# EAGLE design pertamina (EAGLE 7.6.0)
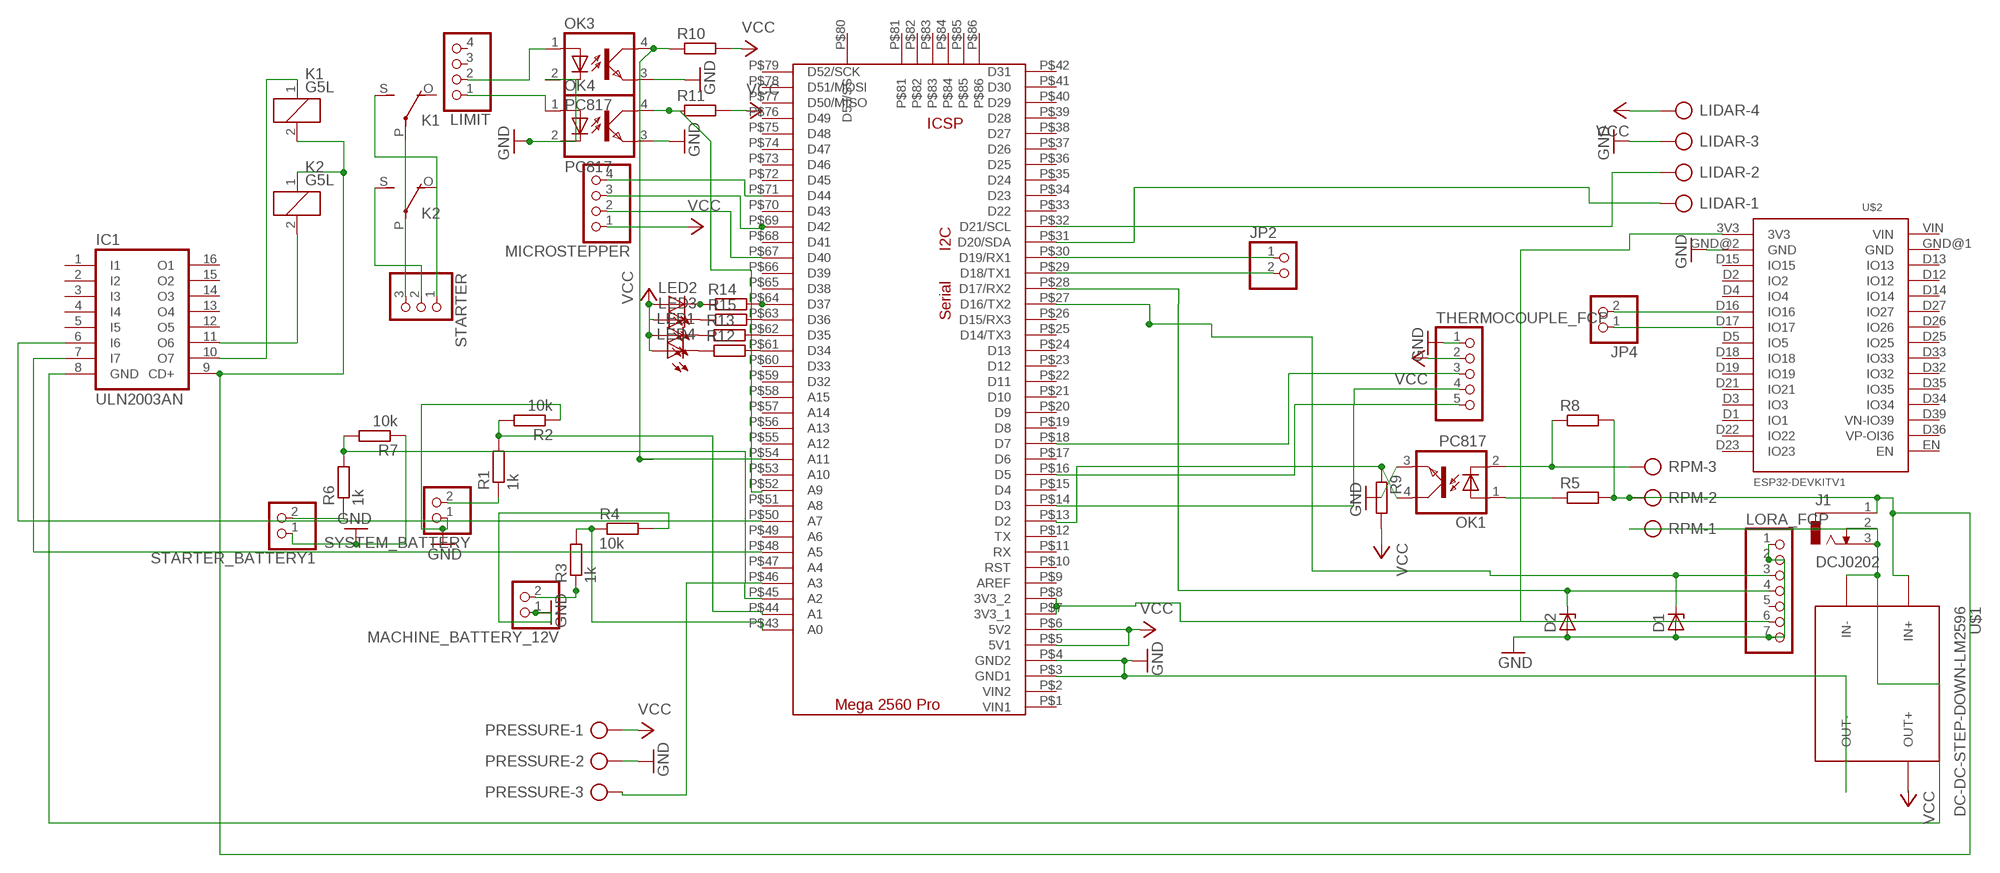
[diagram p0: schematic, sheet 1]

## Parts
D1  ZENER-DIODEDO35Z10  [DO35Z10]
D2  ZENER-DIODEDO35Z10  [DO35Z10]
IC1  ULN2003AN  [DIL16]
J1  DCJ0202  [DCJ0202]
JP2  PINHD-1X2  [1X02]
JP4  PINHD-1X2  [1X02]
K1  G5L  [G5LE]
K2  G5L  [G5LE]
LED1  LED5MM  [LED5MM]
LED2  LED5MM  [LED5MM]
LED3  LED5MM  [LED5MM]
LED4  LED5MM  [LED5MM]
LIDAR  AK300/4  [AK300/4]
LIMIT  PINHD-1X4  [1X04]
LORA_FCP  PINHD-1X7  [1X07]
MACHINE_BATTERY_12V  PINHD-1X2  [1X02]
MICROSTEPPER  PINHD-1X4  [1X04]
OK1  PC817  [DIL04]
OK3  PC817  [DIL04]
OK4  PC817  [DIL04]
PRESSURE  AK300/3  [AK300/3]
R1  1k  R-EU_0204/7  [0204/7]
R2  10k  R-EU_0204/7  [0204/7]
R3  1k  R-EU_0204/7  [0204/7]
R4  10k  R-EU_0204/7  [0204/7]
R5  R-EU_0204/7  [0204/7]
R6  1k  R-EU_0204/7  [0204/7]
R7  10k  R-EU_0204/7  [0204/7]
R8  R-EU_0204/7  [0204/7]
R9  R-EU_0204/7  [0204/7]
R10  R-EU_0204/7  [0204/7]
R11  R-EU_0204/7  [0204/7]
R12  R-EU_0204/7  [0204/7]
R13  R-EU_0204/7  [0204/7]
R14  R-EU_0204/7  [0204/7]
R15  R-EU_0204/7  [0204/7]
RPM  AK300/3  [AK300/3]
STARTER  PINHD-1X3  [1X03]
STARTER_BATTERY1  PINHD-1X2  [1X02]
SYSTEM_BATTERY  PINHD-1X2  [1X02]
THERMOCOUPLE_FCP  PINHD-1X5  [1X05]
U$1  DC-DC-STEP-DOWN-LM2596  [DC-DC-STEP-DOWN-LM2596]
U$2  ESP32DEVKITV1  [ESP32-DEVKITV1]
U$3  MEGAPROMINI  [MEGAPROMINI]

## Nets
3.3V: LORA_FCP.6 U$2.3V3 U$3.P$7(3V3_1) U$3.P$8(3V3_2)
5V: R1.2 R2.2 U$3.P$44(A1)
5V1: R6.2 R7.2 U$3.P$45(A2)
5V_ARDU: LED1.A LED2.A LED3.A LED4.A LIDAR.4 MICROSTEPPER.1 PRESSURE.1 R9.2 R10.2 R11.2 THERMOCOUPLE_FCP.2 U$1.OUT+ U$3.P$5(5V1) U$3.P$6(5V2) ; supply symbol labelled VCC
GND: D1.A D2.A LIDAR.3 LORA_FCP.1 LORA_FCP.2 LORA_FCP.7 MACHINE_BATTERY_12V.1 OK1.3(EMIT) OK3.2(C) OK3.3(EMIT) OK4.2(C) OK4.3(EMIT) PRESSURE.2 R2.1 R4.2 R7.1 STARTER_BATTERY1.1 SYSTEM_BATTERY.1 THERMOCOUPLE_FCP.1 U$1.OUT- U$2.GND@2(GND) U$3.P$3(GND1) U$3.P$4(GND2)
N$1: JP2.1 U$3.P$30(D19/RX1)
N$2: JP2.2 U$3.P$29(D18/TX1)
N$3: R3.2 R4.1 U$3.P$43(A0)
N$4: IC1.10(O7) K1.1
N$5: THERMOCOUPLE_FCP.5 U$3.P$16(D5)
N$6: THERMOCOUPLE_FCP.4 U$3.P$14(D3)
N$8: THERMOCOUPLE_FCP.3 U$3.P$18(D7)
N$9: D2.C LORA_FCP.4 U$3.P$28(D17/RX2)
N$10: R1.1 SYSTEM_BATTERY.2
N$11: IC1.9(CD+) J1.1 K1.2 K2.1 R5.2 R8.2 RPM.2 U$1.IN+
N$12: D1.C LORA_FCP.3 U$3.P$27(D16/TX2)
N$13: MACHINE_BATTERY_12V.2 R3.1
N$14: IC1.8(GND) J1.2 J1.3 RPM.1 U$1.IN-
N$15: OK1.1(A) R5.1
N$16: OK1.4(COL) R9.1 U$3.P$13(D2)
N$17: OK1.2(C) R8.1 RPM.3
N$18: JP4.1 U$2.D17(IO17)
N$19: JP4.2 U$2.D16(IO16)
N$21: IC1.7(I7) U$3.P$48(A5)
N$29: R6.1 STARTER_BATTERY1.2
N$30: R12.2 U$3.P$61(D34)
N$31: LED4.K(C) R12.1
N$32: R14.2 U$3.P$64(D37)
N$33: IC1.6(I6) U$3.P$50(A7)
N$34: MICROSTEPPER.4 U$3.P$71(D44)
N$37: MICROSTEPPER.2 U$3.P$67(D40)
N$38: MICROSTEPPER.3 U$3.P$69(D42)
N$41: PRESSURE.3 U$3.P$46(A3)
N$43: LED2.K(C) R14.1
N$44: IC1.11(O6) K2.2
N$45: R13.2 U$3.P$62(D35)
N$46: LED1.K(C) R13.1
N$47: R15.2 U$3.P$63(D36)
N$48: LED3.K(C) R15.1
N$49: LIMIT.1 OK4.1(A)
N$50: LIMIT.2 OK3.1(A)
N$51: OK4.4(COL) R11.1 U$3.P$52(A9)
N$53: K1.P(2:P) K2.P(2:P) STARTER.3
N$54: K2.S(2:S) STARTER.2
N$55: K1.S(2:S) STARTER.1
N$56: OK3.4(COL) R10.1 U$3.P$54(A11)
SCL: LIDAR.2 U$3.P$32(D21/SCL)
SDA: LIDAR.1 U$3.P$31(D20/SDA)
Unconnected: IC1.1(I1) IC1.2(I2) IC1.3(I3) IC1.4(I4) IC1.5(I5) IC1.12(O5) IC1.13(O4) IC1.14(O3) IC1.15(O2) IC1.16(O1) K1.O(2:O) K2.O(2:O) LIMIT.3 LIMIT.4 LORA_FCP.5 U$2.D1(IO1) U$2.D2(IO2) U$2.D3(IO3) U$2.D4(IO4) U$2.D5(IO5) U$2.D12(IO12) U$2.D13(IO13) U$2.D14(IO14) U$2.D15(IO15) U$2.D18(IO18) U$2.D19(IO19) U$2.D21(IO21) U$2.D22(IO22) U$2.D23(IO23) U$2.D25(IO25) U$2.D26(IO26) U$2.D27(IO27) U$2.D32(IO32) U$2.D33(IO33) U$2.D34(IO34) U$2.D35(IO35) U$2.D36(VP-OI36) U$2.D39(VN-IO39) U$2.EN U$2.GND@1(GND) U$2.VIN U$3.P$1(VIN1) U$3.P$2(VIN2) U$3.P$9(AREF) U$3.P$10(RST) U$3.P$11(RX) U$3.P$12(TX) U$3.P$15(D4) U$3.P$17(D6) U$3.P$19(D8) U$3.P$20(D9) U$3.P$21(D10) U$3.P$22(D11) U$3.P$23(D12) U$3.P$24(D13) U$3.P$25(D14/TX3) U$3.P$26(D15/RX3) U$3.P$33(D22) U$3.P$34(D23) U$3.P$35(D24) U$3.P$36(D25) U$3.P$37(D26) U$3.P$38(D27) U$3.P$39(D28) U$3.P$40(D29) U$3.P$41(D30) U$3.P$42(D31) U$3.P$47(A4) U$3.P$49(A6) U$3.P$51(A8) U$3.P$53(A10) U$3.P$55(A12) U$3.P$56(A13) U$3.P$57(A14) U$3.P$58(A15) U$3.P$59(D32) U$3.P$60(D33) U$3.P$65(D38) U$3.P$66(D39) U$3.P$68(D41) U$3.P$70(D43) U$3.P$72(D45) U$3.P$73(D46) U$3.P$74(D47) U$3.P$75(D48) U$3.P$76(D49) U$3.P$77(D50/MISO) U$3.P$78(D51/MOSI) U$3.P$79(D52/SCK) U$3.P$80(D53/SS) U$3.P$81 U$3.P$82 U$3.P$83 U$3.P$84 U$3.P$85 U$3.P$86

## Library data of the parts
D1 D2 = diode:ZENER-DIODE: Z-Diode
IC1 = uln-udn:ULN2003A: DRIVER ARRAY
J1 = con-jack:DCJ0202: DC POWER JACK Source: DCJ0202.pdf; OC_FARNELL: unknown; OC_NEWARK: unknown
JP2 JP4 MACHINE_BATTERY_12V STARTER_BATTERY1 SYSTEM_BATTERY = pinhead:PINHD-1X2: PIN HEADER
K1 K2 = relay:G5L: RELAY 1 x switch, 10 A/120 V AC, 8 A/30 V ADC, Omron; OC_FARNELL: unknown; OC_NEWARK: unknown
LED1-LED4 = led:LED: LED OSRAM: - CHIPLED LG R971, LG N971, LY N971, LG Q971, LY Q971, LO R971, LY R971 LH N974, LH R974 LS Q976, LO Q976, LY Q976 LO Q996 - Hyper CHIPLED LW Q18S LB Q993, LB Q99A, LB R99A - SideLED LS A670, LO A670, LY A670, LG A670, LP A670 LB A673, LV A673, LT A673, LW A673 LH A674 LY A675 LS A676, LA A676, LO A676, LY A676, LW A676 LS A679, LY A679, LG A679 - Hyper Micro SIDELED® LS Y876, LA Y876, LO Y876, LY Y876 LT Y87S - SmartLED LW L88C, LW L88S LB L89C, LB L89S, LG L890 LS L89K, LO L89K, LY L89K LS L896, LA L896, LO L896, LY L896 - TOPLED LS T670, LO T670, LY T670, LG T670, LP T670 LSG T670, LSP T670, LSY T670, LOP T670, LYG T670 LG T671, LOG T671, LSG T671 LB T673, LV T673, LT T673, LW T673 LH T674 LS T676, LA T676, LO T676, LY T676, LB T676, LH T676, LSB T676, LW T676 LB T67C, LV T67C, LT T67C, LS T67K, LO T67K, LY T67K, LW E67C LS E67B, LA E67B, LO E67B, LY E67B, LB E67C, LV E67C, LT E67C LW T67C LS T679, LY T679, LG T679 LS T770, LO T770, LY T770, LG T770, LP T770 LB T773, LV T773, LT T773, LW T773 LH T774 LS E675, LA E675, LY E675, LS T675 LS T776, LA T776, LO T776, LY T776, LB T776 LHGB T686 LT T68C, LB T68C - Hyper Mini TOPLED® LB M676 - Mini TOPLED Santana® LG M470 LS M47K, LO M47K, LY M47K Source: http://www.osram.convergy.de LUXEON: - LUMILED® LXK2-PW12-R00, LXK2-PW12-S00, LXK2-PW14-U00, LXK2-PW14-V00 LXK2-PM12-R00, LXK2-PM12-S00, LXK2-PM14-U00 LXK2-PE12-Q00, LXK2-PE12-R00, LXK2-PE12-S00, LXK2-PE14-T00, LXK2-PE14-U00 LXK2-PB12-K00, LXK2-PB12-L00, LXK2-PB12-M00, LXK2-PB14-N00, LXK2-PB14-P00, LXK2-PB14-Q00 LXK2-PR12-L00, LXK2-PR12-M00, LXK2-PR14-Q00, LXK2-PR14-R00 LXK2-PD12-Q00, LXK2-PD12-R00, LXK2-PD12-S00 LXK2-PH12-R00, LXK2-PH12-S00 LXK2-PL12-P00, LXK2-PL12-Q00, LXK2-PL12-R00 Source: www.luxeon.com KINGBRIGHT: KA-3528ASYC Source: www.kingbright.com
LIDAR = con-ptr500:AK300/4: CONNECTOR; OC_FARNELL: unknown; OC_NEWARK: unknown
LIMIT MICROSTEPPER = pinhead:PINHD-1X4: PIN HEADER
LORA_FCP = pinhead:PINHD-1X7: PIN HEADER
OK1 OK3 OK4 = optocoupler:PC817: SHARP OPTO COUPLER; MPN: PC817X4J000F; OC_FARNELL: 9707727; OC_NEWARK: 97K7059
PRESSURE RPM = con-ptr500:AK300/3: CONNECTOR; OC_FARNELL: unknown; OC_NEWARK: unknown
R1-R11 = rcl:R-EU_: RESISTOR, European symbol
R12-R15 = resistor:R-EU_: RESISTOR, European symbol
STARTER = pinhead:PINHD-1X3: PIN HEADER
THERMOCOUPLE_FCP = pinhead:PINHD-1X5: PIN HEADER
U$1 = diy-modules:DC-DC-STEP-DOWN-LM2596: DC/DC Step-Down Regulator based on LM2596-ADJ chip LM2596 datasheet available here: http://www.ti.com/lit/ds/symlink/lm2596.pdf Click here to find device on ebay.com <http://www.ebay.com/sch/lm2596+power+regulator>
U$2 = ESP32-DEVKITV1:ESP32DEVKITV1
U$3 = MEGAPROMINI:MEGAPROMINI

## Board
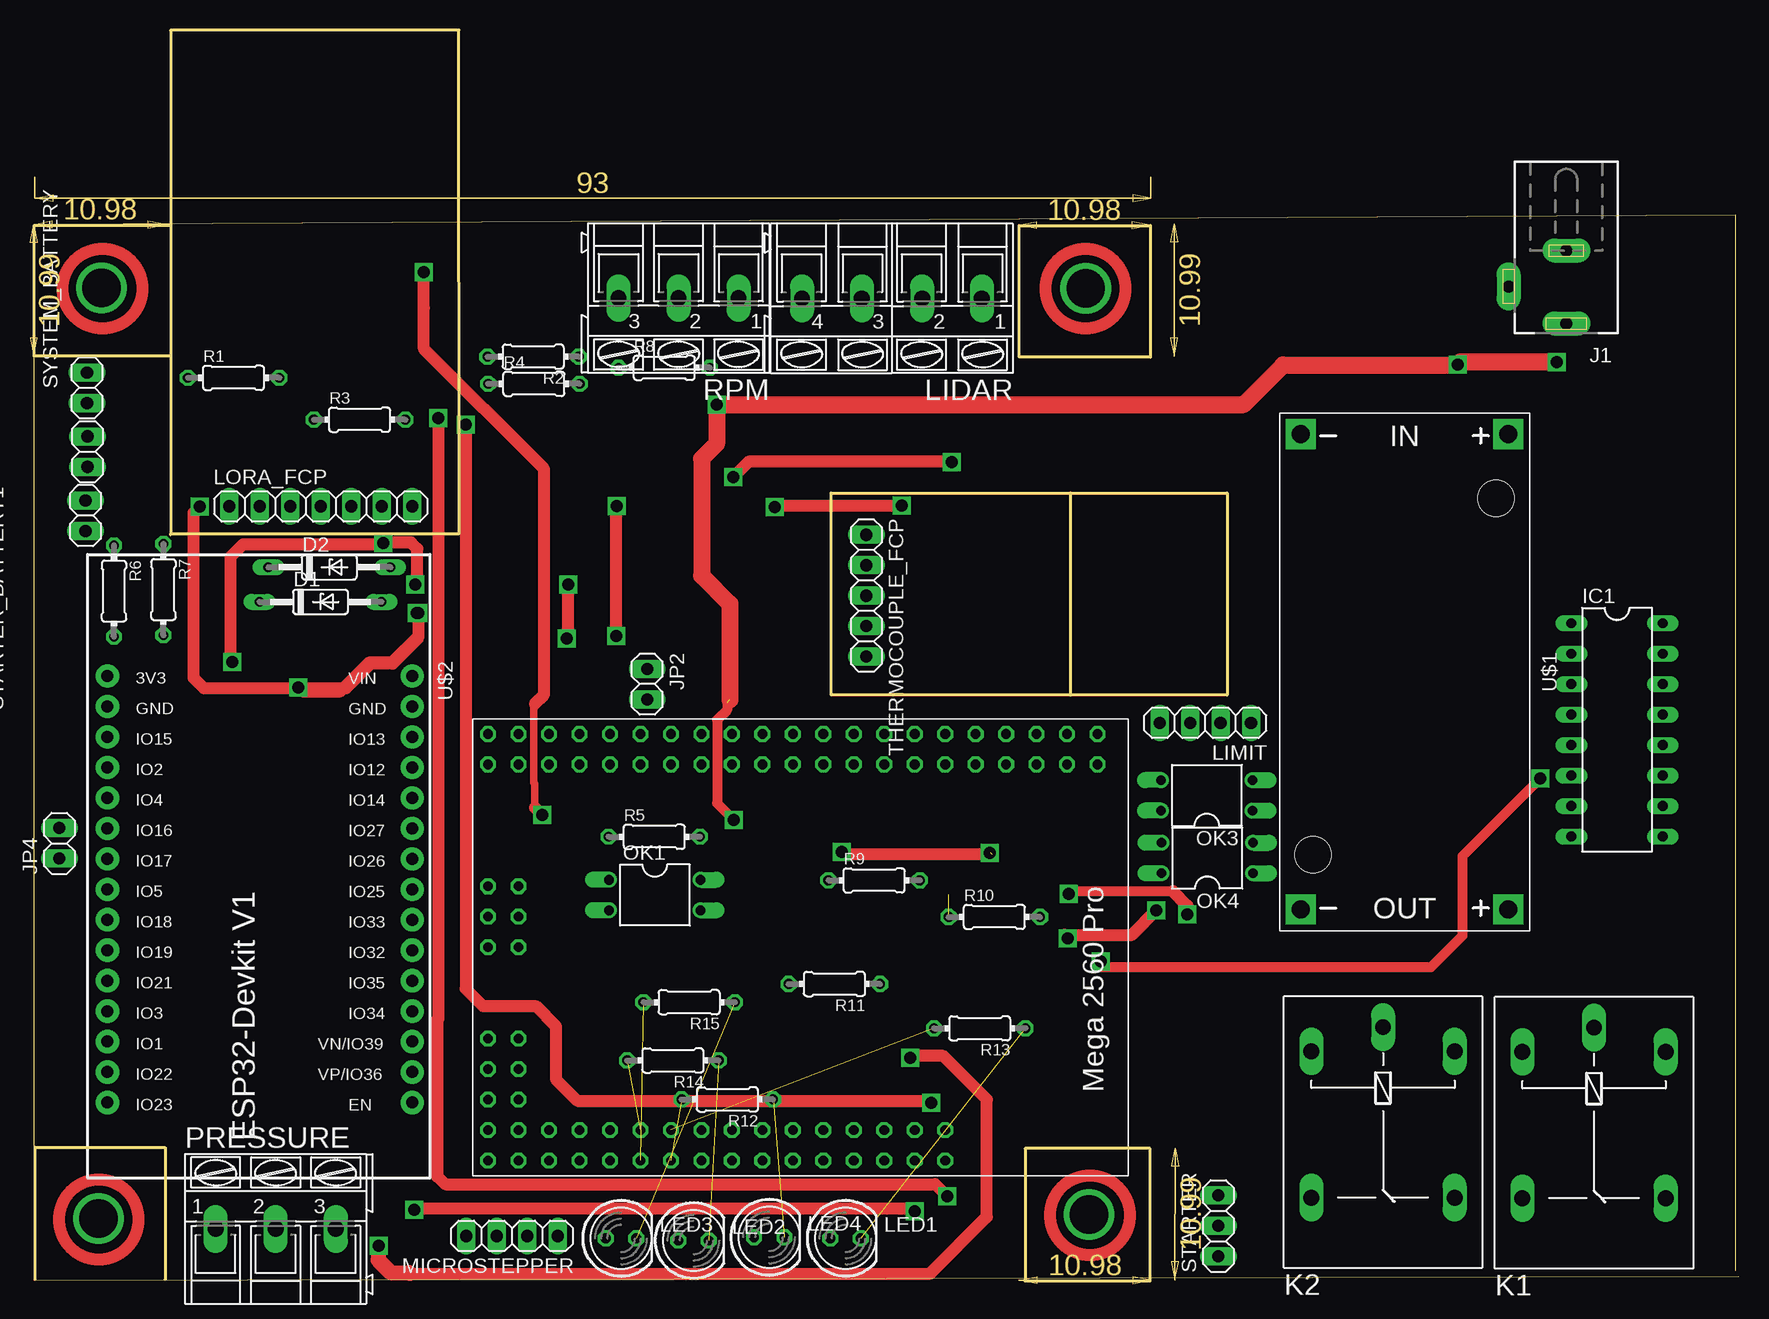
[diagram p1: board, top side]
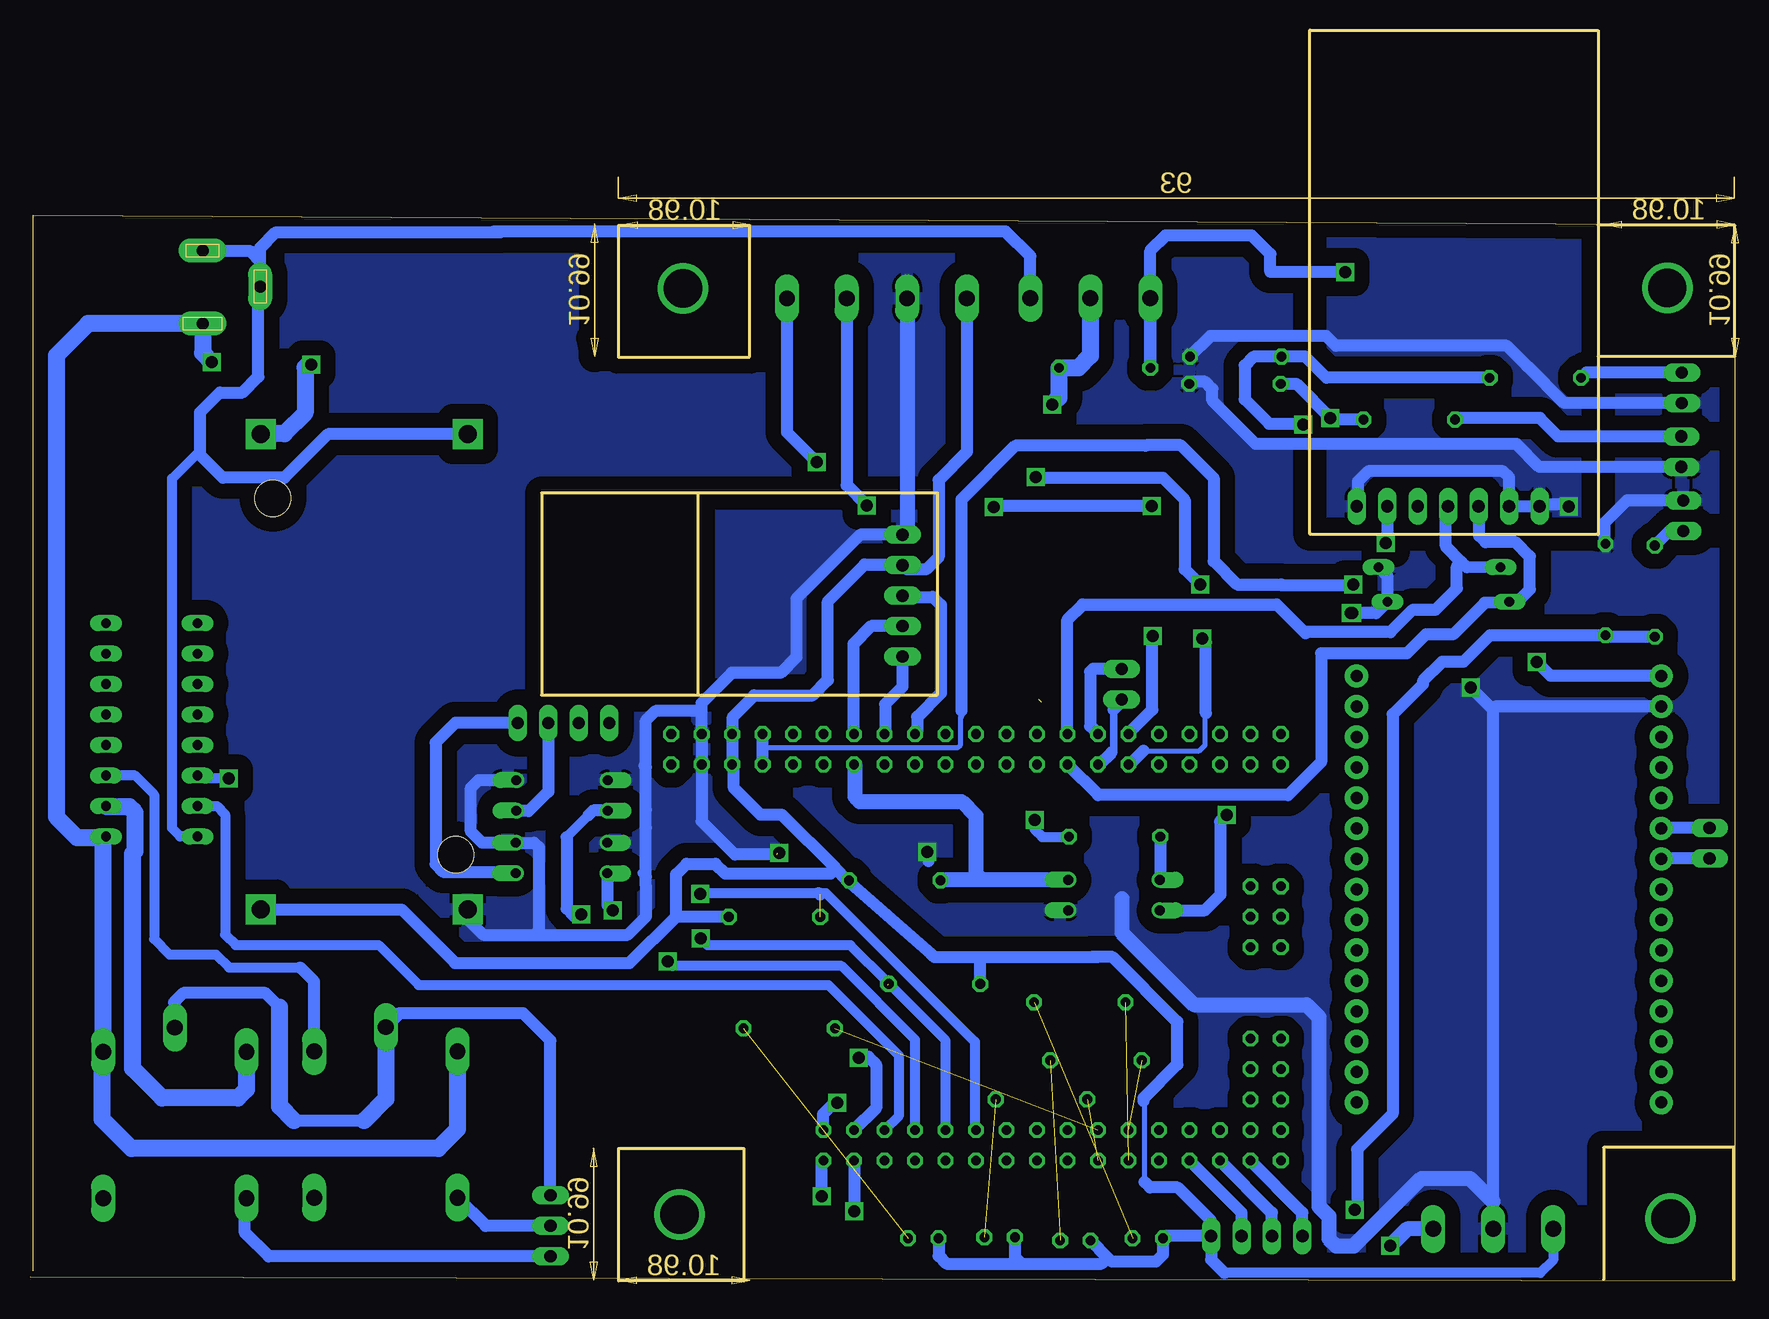
[diagram p2: board, bottom side, seen from below]

Size 142.07 x 104.28 mm. Coordinates in mm from the lower left corner, seen from the top.
Outline: 141.8,0.85 141.8,88.85 0,88.07 0,0.07
Outline: 86.39,48.81 86.39,65.69 99.43,65.69 99.43,48.84 86.37,48.84
Outline: 11.38,62.28 35.43,62.28 35.42,104.28 11.39,104.26 11.39,62.19
Outline: 11.4,88.02 11.4,77.08 0.01,77.08 0.01,88 11.4,88
Outline: 93.01,77.02 82.1,77.02 82.1,87.99 93.04,87.99 93.04,77.01
Outline: 0.09,11.13 10.93,11.13 10.93,0.1
Outline: 0.09,0.13 0.09,11.14
Outline: 142.07,0.33 0.06,0
Outline: 99.43,65.7 99.43,48.85 66.44,48.85 66.44,65.7 99.43,65.7
Outline: 93.01,11.05 82.59,11.05 82.59,0 93.01,0 93.01,11.05
Copper layers (1*16): Top 0.035mm / dielectric 1.5mm / Bottom 0.035mm
Design rules "default": minimum track width 10mil, minimum drill 24mil, track to track 8mil, track to pad 8mil, pad to pad 8mil, via to via 8mil, smd to smd 8mil, copper to edge 40mil, drill to drill 8mil, minimum pad ring 10mil, minimum via ring 8mil, stop-mask expansion 4mil, vias tented up to drill 0mil, thermal gap 10mil

### Footprints (pad centres in the part's own frame; a part is rotated, then mirrored left to right if it is on the bottom)
DO35Z10 = drill 0.813 long: A 5.08,0; C -5.08,0
DIL16 = drill 0.813 long: 1 -8.89,-3.81; 2 -6.35,-3.81; 3 -3.81,-3.81; 4 -1.27,-3.81; 5 1.27,-3.81; 6 3.81,-3.81; 7 6.35,-3.81; 8 8.89,-3.81; 9 8.89,3.81; 10 6.35,3.81; 11 3.81,3.81; 12 1.27,3.81; 13 -1.27,3.81; 14 -3.81,3.81; 15 -6.35,3.81; 16 -8.89,3.81
DCJ0202 = drill 1 pad 2 long: 1 0,3.1; 2 4.8,0; 3 0,-3
1X02 = drill 1.016 long: 1 -1.27,0; 2 1.27,0
G5LE = drill 1.321 long: 1 -7.493,-5.969; 2 -7.493,5.969; O 4.699,5.969; P -9.525,0; S 4.699,-5.969
LED5MM = drill 0.813 octagon: A -1.27,0; K 1.27,0
AK300/4 = drill 1.321 long: 1 -7.493,0; 2 -2.515,0; 3 2.515,0; 4 7.493,0
1X04 = drill 1.016 long: 1 -3.81,0; 2 -1.27,0; 3 1.27,0; 4 3.81,0
1X07 = drill 1.016 long: 1 -7.62,0; 2 -5.08,0; 3 -2.54,0; 4 0,0; 5 2.54,0; 6 5.08,0; 7 7.62,0
DIL04 = drill 0.813 offset: 1 -1.27,-3.81; 2 1.27,-3.81; 3 1.27,3.81; 4 -1.27,3.81
AK300/3 = drill 1.321 long: 1 -5.004,0; 2 0,0; 3 5.004,0
0204/7 = drill 0.813 octagon: 1 -3.81,0; 2 3.81,0
1X03 = drill 1.016 long: 1 -2.54,0; 2 0,0; 3 2.54,0
1X05 = drill 1.016 long: 1 -5.08,0; 2 -2.54,0; 3 0,0; 4 2.54,0; 5 5.08,0
DC-DC-STEP-DOWN-LM2596 = drill 1.5 pad 2.5 square: IN+ -19.812,8.636; IN- -19.812,-8.636; OUT+ 19.812,8.636; OUT- 19.812,-8.636 | hole 3: -14.478,7.62; 15.24,-7.62
ESP32-DEVKITV1 = drill 1 pad 1.93: 3V3 -16.52,-12.27; D1 13.96,-12.27; D2 -8.9,-12.27; D3 11.42,-12.27; D4 -6.36,-12.27; D5 1.26,-12.27; D12 -8.9,13.135; D13 -11.44,13.135; D14 -6.36,13.135; D15 -11.44,-12.27; D16 -3.82,-12.27; D17 -1.28,-12.27; D18 3.8,-12.27; D19 6.34,-12.27; D21 8.88,-12.27; D22 16.5,-12.27; D23 19.04,-12.27; D25 1.26,13.135; D26 -1.28,13.135; D27 -3.82,13.135; D32 6.34,13.135; D33 3.8,13.135; D34 11.42,13.135; D35 8.88,13.135; D36 16.5,13.135; D39 13.96,13.135; EN 19.04,13.135; GND@1 -13.98,13.135; GND@2 -13.98,-12.27; VIN -16.52,13.135
MEGAPROMINI = drill 0.8 octagon: P$1 3.81,-2.54; P$2 1.27,-2.54; P$3 3.81,-5.08; P$4 1.27,-5.08; P$5 3.81,-7.62; P$6 1.27,-7.62; P$7 3.81,-10.16; P$8 1.27,-10.16; P$9 3.81,-12.7; P$10 1.27,-12.7; P$11 3.81,-15.24; P$12 1.27,-15.24; P$13 3.81,-17.78; P$14 1.27,-17.78; P$15 3.81,-20.32; P$16 1.27,-20.32; P$17 3.81,-22.86; P$18 1.27,-22.86; P$19 3.81,-25.4; P$20 1.27,-25.4; P$21 3.81,-27.94; P$22 1.27,-27.94; P$23 3.81,-30.48; P$24 1.27,-30.48; P$25 3.81,-33.02; P$26 1.27,-33.02; P$27 3.81,-35.56; P$28 1.27,-35.56; P$29 3.81,-38.1; P$30 1.27,-38.1; P$31 3.81,-40.64; P$32 1.27,-40.64; P$33 3.81,-43.18; P$34 1.27,-43.18; P$35 3.81,-45.72; P$36 1.27,-45.72; P$37 3.81,-48.26; P$38 1.27,-48.26; P$39 3.81,-50.8; P$40 1.27,-50.8; P$41 3.81,-53.34; P$42 1.27,-53.34; P$43 36.83,-15.24; P$44 34.29,-15.24; P$45 36.83,-17.78; P$46 34.29,-17.78; P$47 36.83,-20.32; P$48 34.29,-20.32; P$49 36.83,-22.86; P$50 34.29,-22.86; P$51 36.83,-25.4; P$52 34.29,-25.4; P$53 36.83,-27.94; P$54 34.29,-27.94; P$55 36.83,-30.48; P$56 34.29,-30.48; P$57 36.83,-33.02; P$58 34.29,-33.02; P$59 36.83,-35.56; P$60 34.29,-35.56; P$61 36.83,-38.1; P$62 34.29,-38.1; P$63 36.83,-40.64; P$64 34.29,-40.64; P$65 36.83,-43.18; P$66 34.29,-43.18; P$67 36.83,-45.72; P$68 34.29,-45.72; P$69 36.83,-48.26; P$70 34.29,-48.26; P$71 36.83,-50.8; P$72 34.29,-50.8; P$73 36.83,-53.34; P$74 34.29,-53.34; P$75 31.75,-53.34; P$76 31.75,-50.8; P$77 29.21,-53.34; P$78 29.21,-50.8; P$79 26.67,-53.34; P$80 26.67,-50.8; P$81 19.05,-53.34; P$82 19.05,-50.8; P$83 16.51,-53.34; P$84 16.51,-50.8; P$85 13.97,-53.34; P$86 13.97,-50.8

### Placement (x,y rotation side)
D1  23.87,56.61 0 top
D2  24.61,59.5 0 top
IC1  131.92,45.94 270 top
J1  127.69,82.91 180 top
JP2  51.1,49.74 270 top
JP4  2.12,36.49 90 top
K1  130,11.59 270 top
K2  112.42,11.64 270 top
LED1  67.63,3.55 0 top
LED2  54.96,3.37 0 top
LED3  48.93,3.55 0 top
LED4  61.27,3.64 0 top
LIDAR  71.5,81.91 180 top
LIMIT  97.61,46.52 180 top
LORA_FCP  23.9,64.57 0 top
MACHINE_BATTERY_12V  4.46,69.13 90 top
MICROSTEPPER  39.84,3.74 180 top
OK1  51.74,32.17 270 top
OK3  97.74,40.48 90 top
OK4  97.78,35.26 90 top
PRESSURE  20.14,4.34 0 top
R1  16.63,75.29 0 top
R2  41.6,77.05 180 top
R3  27.13,71.8 0 top
R4  41.66,74.79 0 top
R5  51.69,37.03 0 top
R6  6.67,57.5 270 top
R7  10.79,57.63 270 top
R8  52.52,76.12 0 top
R9  70.01,33.39 0 top
R10  80.03,30.34 0 top
R11  66.7,24.76 180 top
R12  57.78,15.13 180 top
R13  78.81,21.05 180 top
R14  53.25,18.38 180 top
R15  54.59,23.23 180 top
RPM  53.71,81.93 180 top
STARTER  98.7,4.59 90 top
STARTER_BATTERY1  4.3,63.79 270 top
SYSTEM_BATTERY  4.41,74.45 90 top
THERMOCOUPLE_FCP  69.37,57.12 270 top
U$1  114.21,50.77 270 top
U$2  18.39,33.91 270 top
U$3  91.18,46.87 270 top

### Tracks (layer width: path | path; a pad name or v marks a point on that pad's centre or on a via)
3.3V  (via drill 1)
  Top 1.016: v31.79,58.06 31.9,58.06 31.95,58 31.95,61.03 31.41,61.57 29.15,61.57 v29.09,61.51 29.01,61.42 17.46,61.42 16.42,60.38 16.42,51.67 16.47,51.61 v16.53,51.61
  Bottom 0.406: U$3.P$8 81.02,44.14 80.81,43.94 80.81,43.99 81.02,44.19 81.02,44.46 64.77,44.46 64.53,44.7 64.53,46.98 64.4,47.11 64.4,47.48 64.44,47.52
  Bottom 1.016: U$3.P$7 U$3.P$8 | 64.44,47.52 64.44,65.14 59.96,69.62 49.12,69.62 49.07,69.67 46.18,69.67 43.44,66.94 43.44,60 41.5,58.06 37.83,58.06 37.78,58 31.84,58 v31.79,58.06 | 29.09,61.57 v29.09,61.51 28.98,61.63 LORA_FCP.6 | 6.04,50.35 U$2.3V3 15.34,50.43 v16.53,51.61
5V  (via drill 1)
  Top 1.016: v35.97,71.37 35.97,24.36 37.42,22.91 41.8,22.91 43.5,21.22 43.5,16.82 45.29,15.03 74.59,15.03 v74.79,14.83
  Bottom 1.016: v35.97,71.37 36.05,71.45 38.82,71.45 40.86,73.5 40.86,76.31 40.12,77.05 R2.2 35.81,77.06 34.04,75.29 R1.2 | v74.79,14.83 74.79,14.93 74.69,15.03 74.88,15.03 76,13.9 76,12.64 U$3.P$44
5V1  (via drill 1)
  Top 1.016: 73.58,5.79 v73.39,5.79 73.12,6.06 31.68,6.06 | v31.68,5.92 31.68,6.06 | 31.68,6.06 31.55,6.19
  Bottom 1.016: R6.2 10.66,53.69 R7.2 20.41,53.82 22.62,51.61 24.39,51.61 26.01,50 26.01,49.73 28.51,47.22 28.51,13.93 31.48,10.96 31.48,6.13 v31.68,5.92 | U$3.P$45 v73.4,5.79 v73.39,5.79
5V_ARDU
  Bottom 0.406: 49.18,8.13 49.18,8.25 49.18,14.9 49.27,14.99
  Bottom 0.813: PRESSURE.1 15.14,1.72 16.21,0.66 42.54,0.66
  Bottom 1.016: U$3.P$6 U$3.P$5 83.41,42.91 83.41,41.08 81.19,38.86 79.43,38.86 74.95,34.37 | 83.51,45.64 U$3.P$6 | U$3.P$6 83.51,45.64 83.51,47.03 81.72,48.81 76.84,48.81 75.58,50.08 75.58,56.66 72.51,59.72 69.43,59.72 THERMOCOUPLE_FCP.2 69.01,59.31 67.39,59.31 66.36,60.34 66.36,66.78 64.01,69.13 LIDAR.4 | 53.13,26.98 53.64,26.98 | 66.69,26.99 66.93,27.21 | 66.93,27.21 73.96,33.39 | 73.96,33.39 74.95,34.37 | MICROSTEPPER.1 43.65,1.77 42.54,0.66 | MICROSTEPPER.1 43.65,5 46.44,7.79 48.72,7.79 49.18,8.25 | MICROSTEPPER.1 47.46,3.74 LED3.A 47.66,2.18 48.24,1.6 51.92,1.6 52.27,1.94 | 52.27,1.94 LED2.A | LED1.A 66.36,2.08 65.72,1.43 59.42,1.43 | 59.42,1.43 52.77,1.43 52.27,1.94 | LED4.A 60,2.01 59.42,1.43 | U$1.OUT+ 111.1,30.95 106.64,26.5 92.13,26.5 88.24,30.4 | 88.24,30.4 88.24,33.9 87.36,34.78 84.95,34.78 84.13,33.96 75.36,33.96 74.95,34.37 | R9.2 73.96,33.39 | R10.2 88.19,30.34 88.24,30.4 | 49.27,14.99 49.27,15.22 46.46,18.04 46.46,21.6 51.86,27 53.62,27 53.64,26.98 | 53.64,26.98 63.01,26.98 | 63.01,26.98 66.71,26.98 66.93,27.21 | R11.2 62.89,26.87 63.01,26.98
GND  (via drill 1)  (2 unrouted)
  Top 1.016: v22.03,49.47 22.08,49.47 22.41,49.14 25.53,49.14 27.93,51.54 29.84,51.54 32,53.7 | v79.64,35.66 79.75,35.66 | 79.86,35.55 67.53,35.55 v67.31,35.77 | v32,55.67 32,53.7 | 32,53.7 32,53.58 29.88,51.46 28.06,51.46 26,49.41 14.17,49.41 13.3,50.28 13.3,64.02 v13.83,64.55
  Bottom 0.813: 90.82,39.21 90.75,39.27 | 91.03,33.98 90.75,33.7
  Bottom 1.016: U$3.P$4 U$3.P$3 86.1,38.32 83.32,35.55 79.86,35.55 | 86.2,45.7 U$3.P$4 | U$3.P$4 86.12,45.62 86.12,47.45 | LORA_FCP.7 31.41,64.67 31.41,66.64 30.55,67.5 19.33,67.5 18.82,66.99 LORA_FCP.2 LORA_FCP.1 16.14,64.7 13.83,64.7 v13.83,64.55 | PRESSURE.2 20.14,6.61 20.14,47.59 | 20.14,47.59 v22.03,49.47 | v32,55.67 v31.89,55.67 29.9,55.67 D1.A 28.95,58.76 D2.A | 86.12,47.45 86.12,48.16 83.59,50.68 79.53,50.68 78.21,51.99 78.21,56.87 72.88,62.2 THERMOCOUPLE_FCP.1 | 86.12,47.45 86.17,47.5 89.97,47.5 90.75,46.71 90.75,42.84 | U$2.GND@2 19.84,47.89 20.14,47.59 | 79.72,35.74 v79.64,35.66 | v67.31,35.77 67.31,35.71 67.2,35.6 67.2,35 | 90.75,37.8 90.75,33.7 90.75,32.93 90.74,32.91 90.74,30.4 92.28,28.86 100.02,28.86 | 90.75,37.8 90.75,39.27 90.75,42.84 | 90.77,37.78 90.75,37.8 | 90.88,42.96 90.75,42.84 | U$1.OUT- 105.58,30.15 104.29,28.86 100.02,28.86 | OK3.2 101.56,41.76 104.7,41.76 105.34,41.12 105.34,37.46 104.4,36.52 OK4.2 100.06,36.52 99.68,36.14 99.68,29.21 100.02,28.86 | MACHINE_BATTERY_12V.1 16.29,67.86 18.2,69.77 39.93,69.77 43.55,73.39 43.55,74.36 44.14,74.95 45.3,74.95 R4.2 | SYSTEM_BATTERY.1 14.22,73.19 17.28,76.25 17.31,76.25 19.02,77.96 33.25,77.96 34.06,78.76 43.69,78.76 R2.1 | STARTER_BATTERY1.1 9,65.06 10.87,63.19 10.87,61.53 R7.1
  Bottom 1.27: LIDAR.3 68.98,62.58 THERMOCOUPLE_FCP.1 | 51.08,31.87 51.08,29.02 45.08,23.02 35.69,23.02 34.66,22 34.66,6.22 33.84,5.39 33.84,3.53 33.23,2.92 31.75,2.92 26.12,8.55 22.08,8.55 20.14,6.61
  pour Bottom (isolate 1.27): -0.97,89.1 143.42,89.1 144.08,-1.2 -0.51,-1.2 -0.51,77.64
N$1
  Bottom 1.016: JP2.1 53.48,51.01 53.72,50.77 53.72,46.24 U$3.P$30
N$2
  Bottom 0.61: 51.93,44.07 51.78,44.23 51.78,47.63
  Bottom 1.016: U$3.P$29 52.95,43.05 51.93,44.07 | 51.78,47.63 51.1,48.31 JP2.2
N$3  (via drill 1)
  Top 1.016: v33.71,71.93 33.71,21.86 33.6,21.75 33.6,8.7 33.65,8.7 34.28,8.07 75.1,8.07 v76.11,7.06 75.88,7.3
  Bottom 1.016: R4.1 36.57,74.79 v33.71,71.93 33.58,71.8 R3.2 | 76.03,9.94 U$3.P$43 76.11,9.86 v76.11,7.06
N$4
  Bottom 1.422: K1.1 124.03,15.95 124.74,15.25 131.05,15.25 133.53,17.72 133.53,35.6 133.31,35.82 133.31,39.05 133.78,39.53 135.67,39.53 IC1.10
N$5
  Bottom 1.016: THERMOCOUPLE_FCP.5 69.37,49.53 70.81,48.08 70.81,45.64 U$3.P$16
N$6
  Bottom 1.016: THERMOCOUPLE_FCP.4 71.99,54.58 73.47,53.11 73.47,45.66 U$3.P$14
N$8
  Bottom 1.016: THERMOCOUPLE_FCP.3 69.32,57.12 69.22,57.02 66.85,57.02 66.17,56.35 66.17,49 68.15,47.02 68.15,45.76 U$3.P$18
N$9
  Bottom 1.016: D2.C 22.31,59.47 22.78,59.95 | 22.78,59.95 24.08,61.25 24.08,64.38 LORA_FCP.4 | 22.78,59.95 23.16,59.57 23.16,57.73 24.94,55.95 26.83,55.95 28.7,54.08 35.69,54.08 35.78,53.99 38.19,56.39 54.35,56.39 55.62,55.13 U$3.P$28
N$10
  Bottom 1.016: SYSTEM_BATTERY.2 12.38,75.72 R1.1
N$11  (via drill 1)  (1 unrouted)
  Top 0.813: 57.76,48.23 57.76,47.62 56.93,46.79 56.93,39.81 v58.33,38.41
  Top 1.422: v126.92,76.61 118.86,76.61 v118.63,76.38 118.61,76.36 104.1,76.36 100.81,73.07 v56.88,73.07 56.88,69.78 55.63,68.53 55.63,58.8 58,56.43 58,48.47
  Bottom 0.813: v58.33,38.41 58.37,38.38 58.37,37.65 57.72,37.01 55.52,37.01 R5.2
  Bottom 1.016: 136.06,18.99 K1.2
  Bottom 1.422: K2.1 106.45,12.64 108.05,11.05 133.63,11.05 136.06,13.48 136.06,18.99 | 136.25,36.96 138.16,36.96 139.88,38.69 139.88,77.16 137.24,79.8 J1.1 127.69,77.38 v126.92,76.61 | 136.25,36.96 135.82,36.96 IC1.9 | K1.2 135.97,36.68 136.25,36.96 | v118.63,76.38 118.91,76.38 119.14,76.14 119.14,72.35 120.87,70.63 122.8,70.63 U$1.IN+ | RPM.2 53.71,77.12 54.72,76.11 R8.2 56.33,73.63 v56.88,73.07
N$12
  Bottom 1.016: LORA_FCP.3 21.3,64.52 21.3,62.12 20.77,61.59 18.28,61.59 17.09,60.4 17.09,57.66 18.22,56.53 D1.C 20.85,56.53 23.48,53.9 25.74,53.9 27.34,52.3 34.49,52.3 34.49,43.25 37.23,40.51 53.07,40.51 U$3.P$27
N$13
  Bottom 1.016: MACHINE_BATTERY_12V.2 14.73,70.4 16.25,71.93 23.19,71.93 R3.1
N$14
  Bottom 0.813: IC1.8 129.56,37.05 130.23,37.72 130.23,66.9 127.9,69.22
  Bottom 1.016: RPM.1 58.72,85.41 60.78,87.48 102.85,87.48 | 102.85,87.48 103.4,87.48 | J1.2 122.89,85.03 123.69,85.83 127.62,85.83 J1.3 | J1.2 122.89,86.11 121.59,87.41 102.92,87.41 102.85,87.48 | U$1.IN- 117.25,70.58 120.87,66.96 125.99,66.96 127.9,68.86 127.9,69.22 127.9,72.42 126.26,74.06 124.35,74.06 123.04,75.38 123.04,82.76 J1.2
N$15
  Bottom 1.016: R5.1 47.88,33.48 OK1.1
N$16
  Bottom 1.016: 73.34,43 U$3.P$13
  Bottom 1.27: OK1.4 62.75,33.44 | 62.75,33.44 66.2,33.44 R9.1 | 73.34,43 73.34,40.37 72.93,39.96 64.44,39.96 63.25,38.77 63.25,33.94 62.75,33.44
N$17  (via drill 1)
  Top 0.61: 41.74,39.46 41.74,41.44 41.64,41.55 41.64,47.99 41.74,48.1
  Top 1.016: 42.46,38.86 v42.35,38.86 41.74,39.46 | v32.48,84.1 32.49,81.14 32.49,77.72 42.46,67.75 42.46,48.82 41.74,48.1
  Bottom 1.016: v42.35,38.86 42.91,38.3 42.86,38.25 42.86,32.2 44.17,30.9 OK1.2 | v32.48,84.1 38.68,84.1 38.72,84.14 38.72,85.6 40.28,87.16 47.44,87.16 48.71,85.89 R8.1 48.71,77.61 RPM.3
N$18
  Bottom 1.016: JP4.1 6.09,35.22 U$2.D17
N$19
  Bottom 1.016: JP4.2 6.09,37.76 U$2.D16
N$21
  Bottom 0.813: IC1.7 126.49,39.59 125.8,38.91 125.8,28.86 124.93,28 113.02,28 109.69,24.66 75.54,24.66 69.69,18.82 69.69,13.74 U$3.P$48
N$29
  Bottom 1.016: STARTER_BATTERY1.2 5.46,62.52 R6.1
N$30  (1 unrouted)
N$31  (1 unrouted)
N$32  (1 unrouted)
N$33  (via drill 1)
  Top 0.813: v88.91,26.64 88.91,26.57 88.52,26.18 116.43,26.18 119.04,28.79 119.04,35.42 v125.52,41.9
  Bottom 0.813: U$3.P$50 68.32,20.12 74.44,26.24 88.52,26.24 v88.91,26.64 | v125.52,41.9 127.88,41.9 IC1.6
N$34
  Bottom 1.016: 40.42,9.99 U$3.P$71 36.03,5.69 MICROSTEPPER.4
N$35  (via drill 3.2)
  other vias: 5.63,82.77
N$36  (via drill 3.2)
  other vias: 5.36,5.21
N$37
  Bottom 1.016: 45.5,9.99 U$3.P$67 41.11,5.69 MICROSTEPPER.2
N$38
  Bottom 1.016: 42.96,9.99 U$3.P$69 38.57,5.69 MICROSTEPPER.3
N$39  (via drill 3.2)
  other vias: 87.93,5.55
N$40  (via drill 3.2)
  other vias: 87.65,82.74
N$41  (via drill 1)
  Top 1.016: 31.34,0.6 74.67,0.6 79.41,5.34 79.41,15.13 75.78,18.76 73.17,18.76 v73.01,18.6
  Top 1.27: v28.72,2.93 28.72,2.77 28.67,2.71 28.67,1.72 29.71,0.68 31.26,0.68 31.34,0.6
  Bottom 1.016: v73.01,18.6 73.09,18.6 73.17,18.68 72.2,18.68 71.56,18.04 71.56,14.41 U$3.P$46
  Bottom 1.27: PRESSURE.3 27.32,4.34 v28.72,2.93
N$43  (1 unrouted)
N$44
  Bottom 0.813: IC1.11 133.31,42.12 131.74,40.55 131.74,28.5 130.45,27.22 126.58,27.22 125.48,26.12 119.55,26.12
  Bottom 1.016: K2.2 118.39,24.96 119.55,26.12
N$45  (1 unrouted)
N$46  (1 unrouted)
N$47  (1 unrouted)
N$48  (1 unrouted)
N$49
  Bottom 1.016: LIMIT.1 106.63,46.52 108.27,44.88 108.27,34.72 107.66,34.12 101.72,34.12 OK4.1
N$50
  Bottom 1.016: LIMIT.2 98.88,40.8 100.51,39.17 101.51,39.17 OK3.1
N$51  (via drill 1)  (1 unrouted)
  Top 0.813: v86.17,28.54 86.17,28.57 85.88,28.86
  Top 1.016: 85.88,28.86 91.51,28.86 v93.52,30.87
  Bottom 0.406: 78.06,27.88 78.06,27.98
  Bottom 0.813: U$3.P$52 65.78,20.05 70.6,24.87 73.71,27.98 78.06,27.98 85.61,27.98 v86.17,28.54
  Bottom 1.016: OK4.4 93.97,31.31 v93.52,30.87
  Bottom 1.27: 70.6,24.69 70.6,24.87
N$53
  Bottom 1.016: 114.23,13.35 120.08,13.35 | 121.26,22.82 122.45,24.01 129.29,24.01 130.08,23.22 130,23.14 K1.P | STARTER.3 98.7,20.04 100.97,22.31 111.27,22.31 K2.P
  Bottom 1.422: K2.P 112.42,15.16 114.23,13.35 | 120.08,13.35 121.26,14.54 121.26,22.82
N$54
  Bottom 1.016: STARTER.2 104.1,4.59 K2.S
N$55
  Bottom 1.016: STARTER.1 122.19,2.05 124.16,4.01 124.16,6.77 K1.S
N$56  (via drill 1)  (1 unrouted)
  Top 0.813: 94.92,32.48 86.43,32.48 v86.21,32.26
  Top 1.016: v96.12,30.55 96.12,31.27 94.92,32.48
  Bottom 0.813: v86.21,32.26 86.37,32.26 86.45,32.34 76.35,32.34 75.75,32.34 63.33,19.93 63.33,12.67 U$3.P$54 | 95.52,38.83 97.35,36.99
  Bottom 1.016: 97.35,36.99 97.35,31.03 96.75,30.42 96.24,30.42 v96.12,30.55 | 76.22,32.22 76.35,32.34 | OK3.4 95.14,39.21 95.52,38.83
SCL  (via drill 1)
  Top 1.016: v72.33,64.66 72.4,64.59 61.81,64.59 v61.75,64.53 | 48.51,53.61 v48.51,53.74 48.51,64.53 v48.57,64.59
  Bottom 1.016: LIDAR.2 74.01,66.34 v72.33,64.66 | 61.75,64.66 v61.75,64.53 61.68,64.59 v48.57,64.59 48.44,64.59 | U$3.P$32 50.54,45.63 48.54,47.62 48.54,53.71 v48.51,53.74
SDA  (via drill 1)
  Top 1.016: v76.5,68.25 76.55,68.25 76.61,68.3 59.55,68.3 v58.26,67.01 | v44.54,58.04 44.52,58.04 44.5,58.02 44.5,53.67 v44.38,53.55
  Bottom 0.406: 49.29,44.19 44.64,44.19 44.15,44.67 44.15,47.25 44.08,47.31
  Bottom 1.016: U$3.P$31 50.43,43.05 49.29,44.19 | 44.08,47.31 44.08,53.26 44.21,53.38 v44.38,53.55 | LIDAR.1 78.99,70.74 v76.5,68.25 | v58.26,67.01 58.21,66.96 47.67,66.96 45.84,65.12 45.84,59.34 v44.54,58.04
(copper drawn outside any net)
  shapes: Top circle x4